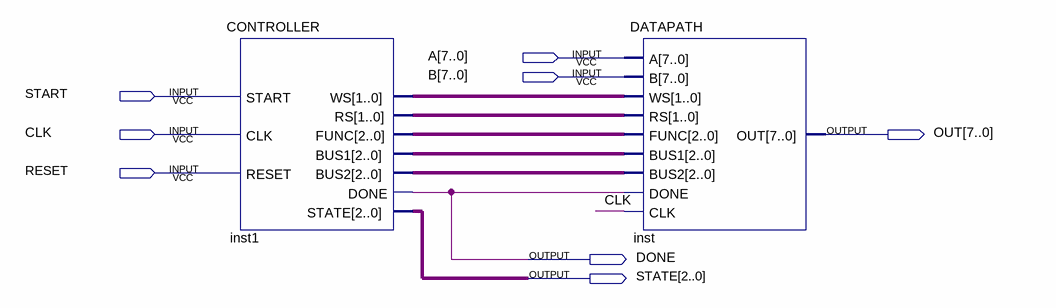
[diagram p0: schematic sheet]
// Quartus schematic MAIN.bdf as structural Verilog: 2 symbols, 8 pins
module MAIN (
  input  [7:0] A,
  input  [7:0] B,
  input  START,
  input  CLK,
  input  RESET,
  output [7:0] OUT,
  output DONE,
  output [2:0] STATE
);

  wire [1:0] inst1_rs, inst1_ws;
  wire [2:0] inst1_bus1, inst1_bus2, inst1_func;

  CONTROLLER inst1 (
    .START(START), .CLK(CLK), .RESET(RESET), .RS(inst1_rs), .WS(inst1_ws), .FUNC(inst1_func),
    .BUS2(inst1_bus2), .BUS1(inst1_bus1), .DONE(DONE), .STATE(STATE));
  DATAPATH inst (
    .A(A), .B(B), .WS(inst1_ws), .RS(inst1_rs), .FUNC(inst1_func), .BUS1(inst1_bus1), .BUS2(inst1_bus2),
    .DONE(DONE), .CLK(CLK), .OUT(OUT));
endmodule
